# Altium schematic sheet FDC.SchDoc
size A4
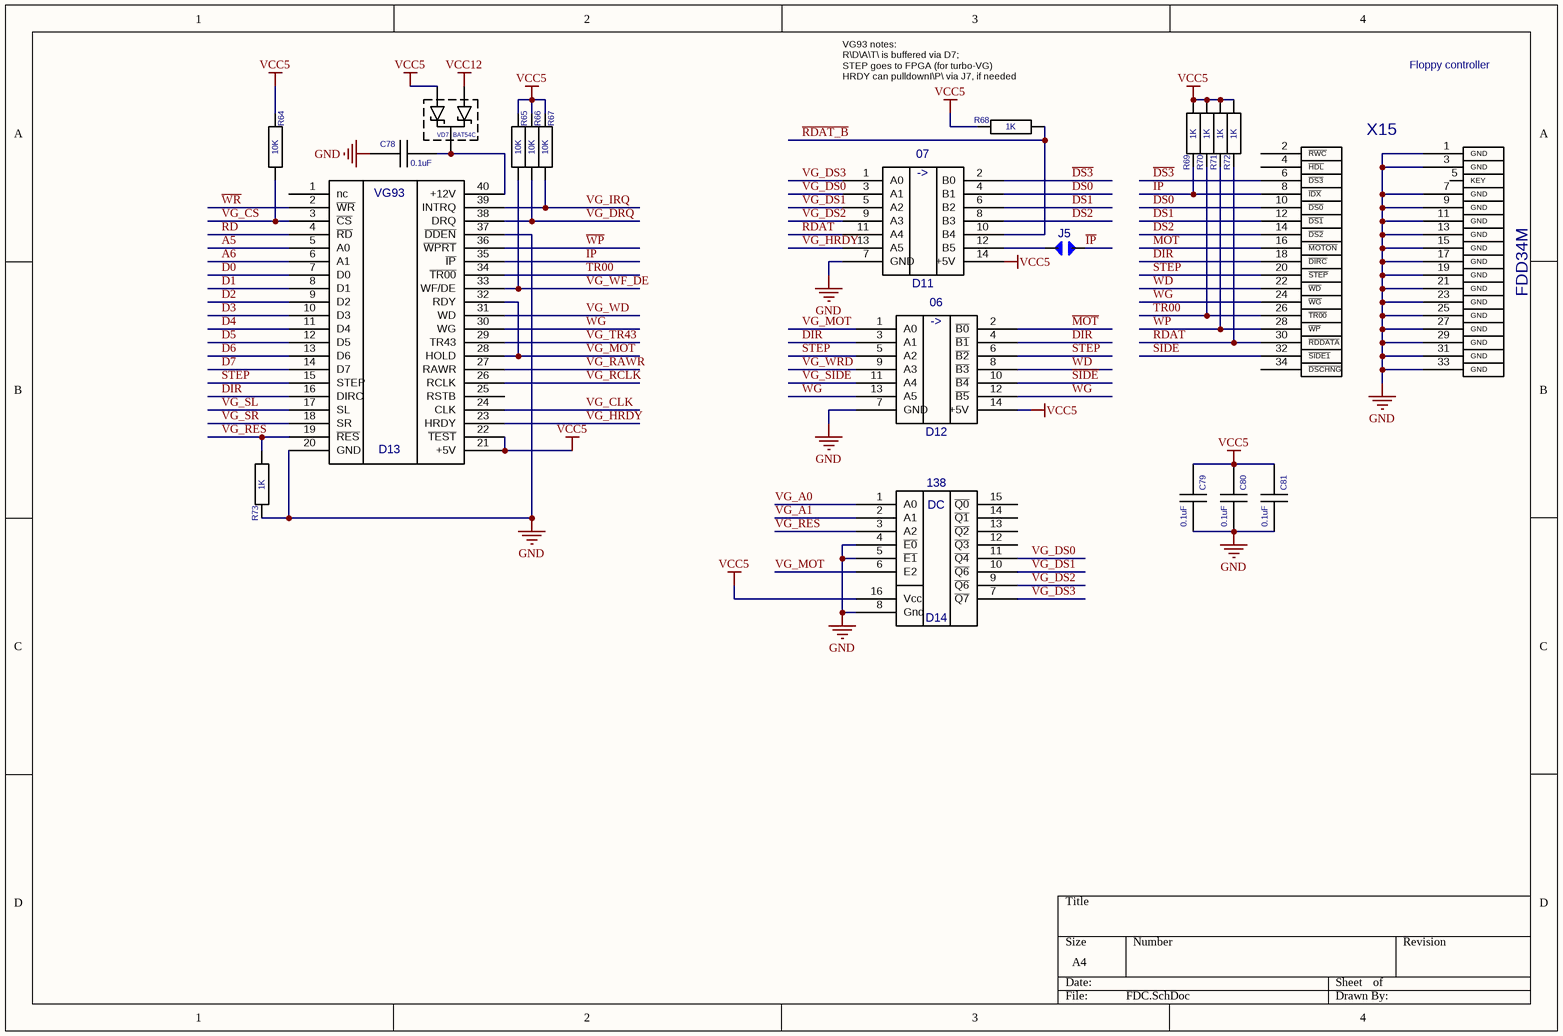
[diagram p0: FDC.SchDoc]

## Parts
C78  value 0.1uF  [C-CHIP]  (hidden comment: CAPCHIP)
C79  value 0.1uF  [C-CHIP]  (hidden comment: CAPCHIP)
C80  value 0.1uF  [C-CHIP]  (hidden comment: CAPCHIP)
C81  value 0.1uF  [C-CHIP]  (hidden comment: CAPCHIP)
D11  07  [SO14]
D12  06  [SO14]
D13  KR1818VG93  [DIP40]  (value not drawn)
D14  138  [SO16]
J5  JUMPER  [JUMPER]  (value not drawn)
R64  value 10K  [R-CHIP]  (hidden comment: RESCHIP)
R65  value 10K  [R-CHIP]  (hidden comment: RESCHIP)
R66  value 10K  [R-CHIP]  (hidden comment: RESCHIP)
R67  value 10K  [R-CHIP]  (hidden comment: RESCHIP)
R68  value 1K  [R-CHIP]  (hidden comment: RESCHIP)
R69  value 1K  [R-CHIP]  (hidden comment: RESCHIP)
R70  value 1K  [R-CHIP]  (hidden comment: RESCHIP)
R71  value 1K  [R-CHIP]  (hidden comment: RESCHIP)
R72  value 1K  [R-CHIP]  (hidden comment: RESCHIP)
R73  value 1K  [R-CHIP]  (hidden comment: RESCHIP)
VD7  BAT54C  [SOT-23]
X15  FDD34M  [FDD34M]

## Nets
GND: C78.1 C79.2 C80.2 C81.2 D11.7(GND) D12.7(GND) D13.20(GND) D13.37(~{DDEN}) D14.4(~{E0}) D14.5(~{E1}) D14.8(Gnd) R73.2(i/o1) X15.1(GND) X15.3(GND) X15.7(GND) X15.9(GND) X15.11(GND) X15.13(GND) X15.15(GND) X15.17(GND) X15.19(GND) X15.21(GND) X15.23(GND) X15.25(GND) X15.27(GND) X15.29(GND) X15.31(GND) X15.33(GND)
VCC5: C79.1 C80.1 C81.1 D11.14(+5V) D12.14(+5V) D13.21(+5V) D13.22(~{TEST}) D14.16(Vcc) R64.2(i/o1) R65.2(i/o1) R66.2(i/o1) R67.2(i/o1) R68.2(i/o1) R69.1(i/o) R70.1(i/o) R71.1(i/o) R72.1(i/o) VD7.2
VCC12: VD7.1
A5: D13.5(A0)
A6: D13.6(A1)
D0: D13.7(D0)
D1: D13.8(D1)
D2: D13.9(D2)
D3: D13.10(D3)
D4: D13.11(D4)
D5: D13.12(D5)
D6: D13.13(D6)
D7: D13.14(D7)
~{DIR}: D12.4(~{B1}) X15.18(~{DIRC})
~{DS0}: D11.4(B1) X15.10(~{DS0})
~{DS1}: D11.6(B2) X15.12(~{DS1})
~{DS2}: D11.8(B3) X15.14(~{DS2})
~{DS3}: D11.2(B0) X15.6(~{DS3})
DIR: D12.3(A1) D13.16(DIRC)
~{IP}: D13.35(~{IP}) J5.1 R69.2(i/o1) X15.8(~{IDX})
~{MOT}: D12.2(~{B0}) X15.16(~{MOTON})
~{RD}: D13.4(~{RD})
~{RDAT}: D11.11(A4) R72.2(i/o1) X15.30(~{RDDATA})
~{RDAT_B}: D11.10(B4) R68.1(i/o)
~{SIDE}: D12.10(~{B4}) X15.32(~{SIDE1})
~{STEP}: D12.6(~{B2}) X15.20(~{STEP})
STEP: D12.5(A2) D13.15(STEP)
~{TR00}: D13.34(~{TR00}) R70.2(i/o1) X15.26(~{TR00})
~{VG_CS}: D13.3(~{CS}) R64.1(i/o)
~{VG_RES}: D13.19(~{RES}) D14.3(A2) R73.1(i/o)
VG_A0: D14.1(A0)
VG_A1: D14.2(A1)
VG_CLK: D13.24(CLK)
VG_DRQ: D13.38(DRQ) R66.1(i/o)
VG_DS0: D11.3(A1) D14.11(~{Q4})
VG_DS1: D11.5(A2) D14.10(~{Q6})
VG_DS2: D11.9(A3) D14.9(~{Q6})
VG_DS3: D11.1(A0) D14.7(~{Q7})
VG_HRDY: D11.13(A5) D13.23(HRDY)
VG_IRQ: D13.39(INTRQ) R67.1(i/o)
VG_MOT: D12.1(A0) D13.28(HOLD) D13.32(RDY) D14.6(E2)
VG_RAWR: D13.27(RAWR)
VG_RCLK: D13.26(RCLK)
VG_SIDE: D12.11(A4)
VG_SL: D13.17(SL)
VG_SR: D13.18(SR)
VG_TR43: D13.29(TR43)
VG_WD: D13.31(WD)
VG_WF_DE: D13.33(WF/DE) R65.1(i/o)
VG_WRD: D12.9(A3)
~{WD}: D12.8(~{B3}) X15.22(~{WD})
~{WG}: D12.12(~{B5}) X15.24(~{WG})
~{WP}: D13.36(~{WPRT}) R71.2(i/o1) X15.28(~{WP})
~{WR}: D13.2(~{WR})
WG: D12.13(A5) D13.30(WG)
NetC78_2: C78.2 D13.40(+12V) VD7.3
NetD11_12: D11.12(B5) J5.0

Not connected (* = marked no-connect by the designer): D13 1(nc) 25(RSTB); D14 12(~{Q3}) 13(~{Q2}) 14(~{Q1}) 15(~{Q0}); X15 2(~{RWC}) 4(~{HDL}) 5(KEY) 34(~{DSCHNG})

## Notes on the sheet
- (near R68) VG93 notes:
  R\D\A\T\ is buffered via D7;
  STEP goes to FPGA (for turbo-VG)
  HRDY can pulldownI\P\ via J7, if needed
- Floppy controller
- (in symbol 06) ->
- (in symbol 07) ->
- (in symbol 138) DC
- (in symbol KR1818VG93) VG93

## Library data of the parts
J5 = JUMPER: HLT->~IP
D11 = 07: Value: *
D12 = 06: Value: *
D13 = KR1818VG93: Value: *
D14 = 138: Value: *
VD7 = BAT54C: Value: *
X15 = FDD34M: Value: *